# Altium schematic sheet base.SchDoc
size A4
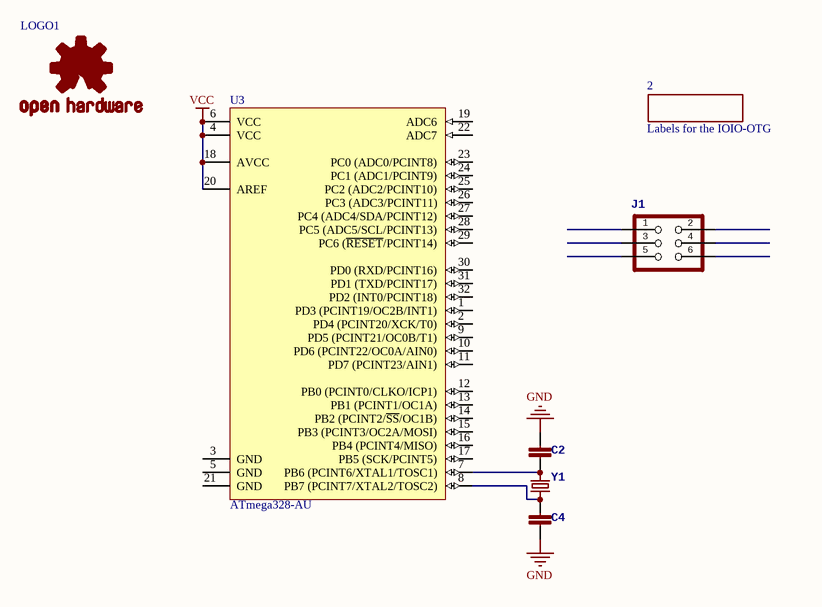
[diagram p0: base.SchDoc]

## Parts
2  Labels for the IOIO-OTG  [IOIO-OTG-COPPER-EXPOSED]
C2  (no value)  [C0805K]
C4  (no value)  [C0805K]
J1  (no value)  [2X3-NS]
LOGO1  (no value)  [OSHW-LOGO-L_COPPER]
U3  ATmega328-AU  [32A_N]
Y1  (no value)  [HC49UP]

## Nets
GND: C2.2 C4.1
VCC: U3.4(VCC) U3.6(VCC) U3.18(AVCC) U3.20(AREF)
NetC2_1: C2.1 U3.7(PB6_(PCINT6/XTAL1/TOSC1)) Y1.2
NetC4_2: C4.2 U3.8(PB7_(PCINT7/XTAL2/TOSC2)) Y1.1

Not connected (* = marked no-connect by the designer): J1 1 2 3 4 5 6; U3 1(PD3_(PCINT19/OC2B/INT1)) 2(PD4_(PCINT20/XCK/T0)) 3(GND) 5(GND) 9(PD5_(PCINT21/OC0B/T1)) 10(PD6_(PCINT22/OC0A/AIN0)) 11(PD7_(PCINT23/AIN1)) 12(PB0_(PCINT0/CLKO/ICP1)) 13(PB1_(PCINT1/OC1A)) 14(PB2_(PCINT2/~{SS}/OC1B)) 15(PB3_(PCINT3/OC2A/MOSI)) 16(PB4_(PCINT4/MISO)) 17(PB5_(SCK/PCINT5)) 19(ADC6) 21(GND) 22(ADC7) 23(PC0_(ADC0/PCINT8)) 24(PC1_(ADC1/PCINT9)) 25(PC2_(ADC2/PCINT10)) 26(PC3_(ADC3/PCINT11)) 27(PC4_(ADC4/SDA/PCINT12)) 28(PC5_(ADC5/SCL/PCINT13)) 29(PC6_(~{RESET}/PCINT14)) 30(PD0_(RXD/PCINT16)) 31(PD1_(TXD/PCINT17)) 32(PD2_(INT0/PCINT18))

## Library data of the parts
2 = IOIO-OTG
C2 C4 = C-EUC0805K
J1 = AVR_SPI_PRG_6NS
LOGO1 = OSHW-LOGOL-COPPER
U3 = ATmega328-AU: 8-bit AVR Microcontroller, 32KB Flash, 1KB EEPROM, 2KB SRAM, 32-pin TQFP, Industrial Grade (-40°C to 85°C); DatasheetVersion: revD, May-2011; PackageVersion: revC, Oct-2010; PackageReference: 32A; PackageDescription: 32-Lead, 7x7x1.0 mm Body, 0.8mm Lead Pitch, Thin Profile Plastic Quad Flat Package (TQFP); Code_JEDEC: MS-026-ABA; ComponentLink1Description: Manufacturer URL; ComponentLink1URL: http://www.atmel.com/; ComponentLink2Description: ATmega48A/48PA/88A/88PA/168A/168PA/328/328P Datasheet; ComponentLink2URL: http://www.atmel.com/dyn/resources/prod_documents/doc8271.pdf; ComponentLink3Description: ATmega48A/48PA/88A/88PA/168A/168PA/328/328P Summary; ComponentLink3URL: http://www.atmel.com/dyn/resources/prod_documents/8271S.pdf
Y1 = CRYSTALSMD